# Altium project PROC101D_SCH_With_Design_Updates..Notes_V1.0.PrjPcb (part 23 of 23)
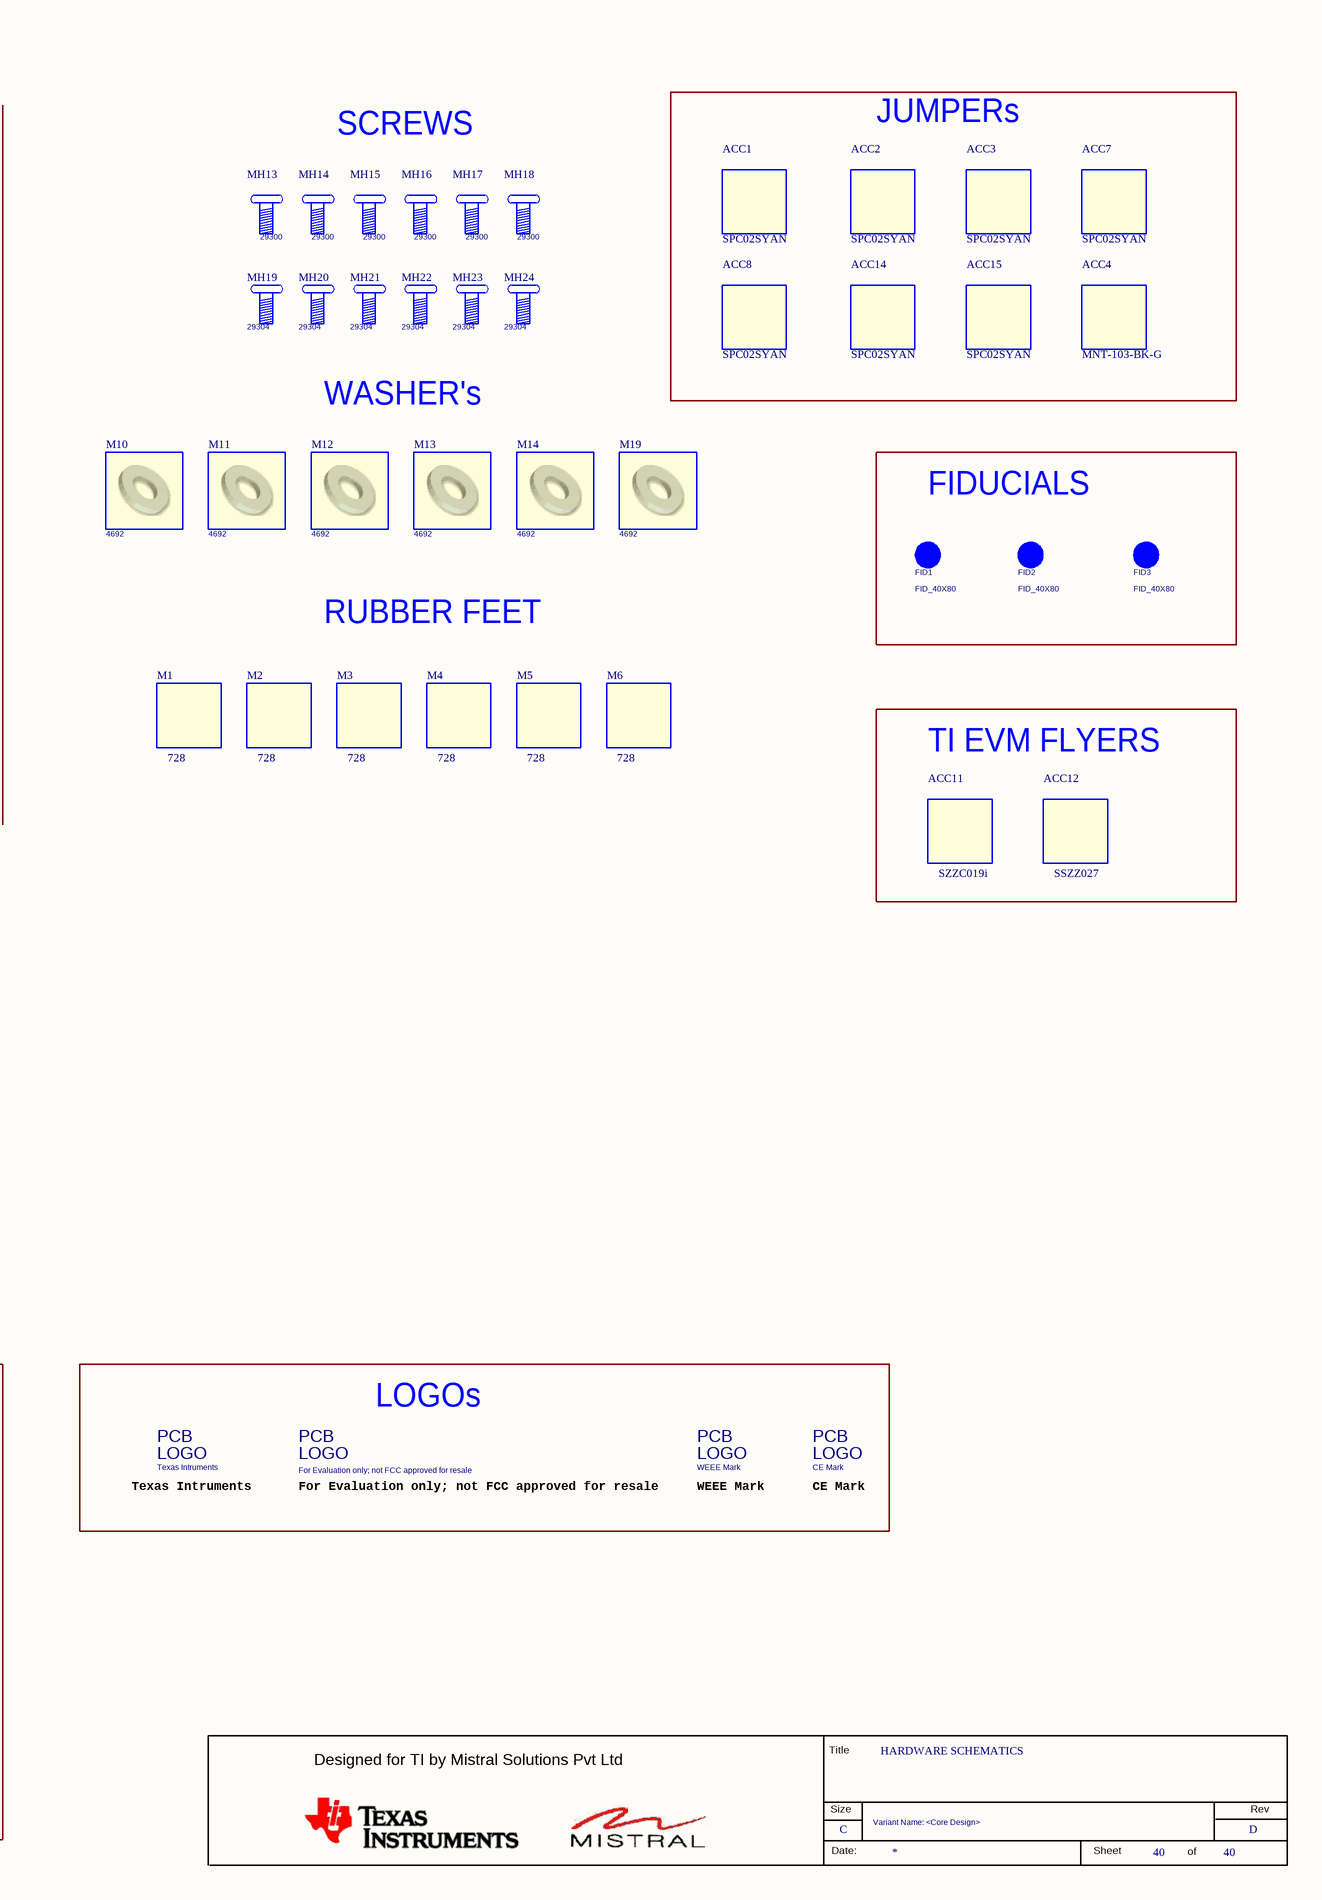
[diagram p78: 40.SchDoc, right]

## Nets that join several sheets
DDR_VREFCA: 12 (C42.2 U13.M1), 39 (C218.1 U68.6)
DGND: 09 (42 pins), 10 (74 pins), 11 (68 pins), 12 (54 pins), 13 (39 pins), 14 (15 pins), 15 (17 pins), 16 (45 pins), 17 (38 pins), 18 (36 pins), 19 (12 pins), 20 (37 pins), 21 (23 pins), 22 (46 pins), 23 (35 pins), 24 (36 pins), 25 (15 pins), 26 (58 pins), 27 (68 pins), 28 (8 pins), 29 (31 pins), 30 (37 pins), 31 (60 pins), 32 (16 pins), 33 (8 pins), 34 (22 pins), 35 (35 pins), 36 (19 pins), 37 (53 pins), 38 (35 pins), 39 (42 pins)
PRG_EARTH: 17 (J21.SH3 J21.SH4), 18 (C295.1 J21.SH1 J21.SH2 R304.1)
SOC_DVDD1V8: 09 (6 pins), 10 (6 pins), 21 (J13.2 R233.3)
SoC_DVDD3V3: 09 (17 pins), 10 (19 pins), 21 (J19.2 R295.1)
VCC1V2_DDR: 21 (C21.2 J8.1 R22.1), 38 (5 pins)
VCC1V8: 13 (20 pins), 14 (22 pins), 21 (C221.2 J13.1 R233.2), 27 (C212.1 U63.1 U63.3), 31 (FB25.1 FL17.1 FL18.1), 33 (C30.2 R24.2 U10.3), 34 (C485.2 R575.1 U35.5), 38 (5 pins)
VCC3V3_PREREG: 35 (5 pins), 37 (6 pins), 38 (21 pins)
VCC3V3_XDS: 22 (37 pins), 23 (6 pins)
VCC_3V3_SYS: 13 (15 pins), 14 (R197.2 R210.2), 15 (17 pins), 16 (34 pins), 17 (26 pins), 18 (24 pins), 19 (C161.1 U51.8), 20 (22 pins), 21 (20 pins), 23 (28 pins), 24 (23 pins), 25 (R153.1), 26 (13 pins), 27 (C216.1 R19.2 U64.1 U64.3), 28 (C26.1 C29.1 J7.10 U8.5), 29 (16 pins), 30 (13 pins), 31 (5 pins), 32 (10 pins), 33 (6 pins), 34 (11 pins), 35 (10 pins), 36 (6 pins), 37 (7 pins), 38 (R143.2), 39 (18 pins)
VCC_5V0: 09 (R314.1), 25 (C139.2 FL7.1), 27 (C15.1 U2.1 U2.3), 29 (FB2.1), 35 (C271.2 R266.1 U74.5), 37 (8 pins)
VCC_CORE: 21 (C72.2 J20.1 R92.3), 38 (C77.1 C486.1 L4.2 TP23.1)
VDD_0V85: 21 (C31.2 J11.1 R227.4), 38 (C33.1 TP8.1 U12.8)
VDD_1V0: 16 (13 pins), 39 (C280.1 TP56.1 U77.1)
VDD_1V1: 17 (10 pins), 18 (10 pins), 39 (5 pins)
VDD_2V5: 16 (7 pins), 17 (7 pins), 18 (7 pins), 39 (5 pins)
VDD_2V8: 29 (C463.2 J36.7 R538.1), 39 (C471.1 R556.1 TP99.1 U100.1)
VDD_CORE: 09 (13 pins), 10 (19 pins), 21 (J20.2 R92.2), 35 (R284.1), 38 (C96.1 R118.1 TP14.1)
VDD_DDR4: 09 (7 pins), 10 (11 pins), 12 (37 pins), 21 (J8.2 R22.4), 39 (C213.2 U68.1)
VDD_MMC1: 09 (U23.H15), 10 (C119.1 C382.1), 13 (5 pins)
VDDA1V8: 21 (C117.2 J22.1 R351.2), 38 (C129.1 R144.1 TP29.1 U33.1)
VDDA_1V8: 09 (10 pins), 10 (5 pins), 21 (J22.2 R351.3)
VDDA_1V8_SERDES: 09 (5 pins), 30 (R632.2)
VDDA_ADC: 09 (5 pins), 32 (C4.2 C7.2 J3.4 J3.17)
VDDAR_CORE: 09 (R75.1 R297.1), 21 (J11.2 R227.1), 38 (R44.1 TP10.1)
VDDR_CORE: 09 (R106.2 R297.2 U23.L10 U23.M13), 10 (6 pins), 35 (R282.1)
VDDR_VTT: 12 (38 pins), 39 (C210.2 TP48.1 U68.3 U68.5)
VDDS_MMC0/ADC0_VREFP: 09 (R698.2 R699.1 U23.J15), 11 (C541.1)
VDDSHV_SD_IO: 09 (C400.1 U23.K15 U23.L14 U23.L15), 10 (C372.1 C381.1), 13 (9 pins)
VMAIN: 09 (R604.1), 30 (10 pins), 36 (C56.1 D3.3 R80.2 TP81.1), 37 (10 pins), 39 (C452.1 R500.1 U97.2)
VOUT_TA: 19 (18 pins), 20 (12 pins), 37 (C494.2 U102.5), 39 (7 pins)
VPP_1V8: 09 (U23.G15), 38 (C243.1 TP52.1 U72.1)
VPP_DDR_2V5: 12 (FB11.1), 39 (C201.1 TP47.1 U62.1)
BOOTMODE0: 20 (R325.1), 28 (RA1.8 RA2.1 U23.T20)
BOOTMODE1: 20 (R326.1), 28 (RA1.7 RA2.2 U23.U21)
BOOTMODE2: 20 (R327.1), 28 (RA1.6 RA2.3 U23.T18)
BOOTMODE3: 20 (R328.1), 28 (RA1.5 RA2.4 U23.U20)
BOOTMODE4: 20 (R329.1), 28 (RA1.4 RA2.5 U23.U18)
BOOTMODE5: 20 (R330.1), 28 (RA1.3 RA2.6 U23.U19)
BOOTMODE6: 20 (R331.1), 28 (RA1.2 RA2.7 U23.V20)
BOOTMODE7: 20 (R332.1), 28 (RA1.1 RA2.8 U23.V21)
BOOTMODE8: 20 (R372.1), 28 (RA3.8 RA4.1 U23.V19)
BOOTMODE9: 20 (R373.1), 28 (RA3.7 RA4.2 U23.T17)
BOOTMODE10: 20 (R374.1), 28 (RA3.6 RA4.3 U23.R16)
BOOTMODE11: 20 (R375.1), 28 (RA3.5 RA4.4 U23.W20)
BOOTMODE12: 20 (R376.1), 28 (RA3.4 RA4.5 U23.W21)
BOOTMODE13: 20 (R377.1), 28 (RA3.3 RA4.6 U23.V18)
BOOTMODE14: 20 (R378.1), 28 (RA3.2 RA4.7 U23.Y21)
BOOTMODE15: 20 (R379.1), 28 (RA3.1 RA4.8 U23.Y20)
BOOTMODE_I2C_SCL: 19 (J38.37 R550.2), 20 (TP43.1 U96.29)
BOOTMODE_I2C_SDA: 19 (J38.39 R551.2), 20 (TP42.1 U96.30)
CAN_MUX_SEL: 29 (R16.1 U67.1), 33 (U91.2)
CDC_OE1/OE4: 31 (R672.2 R688.2 U105.11), 33 (U91.18)
CLKGEN_REFCLK1N: 30 (R661.1), 31 (R653.2 R682.1)
CLKGEN_REFCLK1P: 30 (R662.1), 31 (R652.2 R681.1)
CLKGEN_REFCLK4N: 30 (R667.1), 31 (R655.2 R684.1)
CLKGEN_REFCLK4P: 30 (R668.1), 31 (R654.2 R683.1)
CLKOUT0: 29 (R345.2), 31 (R50.2 R257.1 U70.13)
CPSW_FET_SEL: 16 (R292.1 U75.9 U75.10), 33 (U91.11)
CPSW_RGMII1_ETH1_CLK: 16 (U15.15), 31 (R239.2)
CPSW_RGMII1_MDC: 16 (R81.2 U15.16), 17 (U27.7), 27 (TP64.1 U23.R2)
CPSW_RGMII1_MDIO: 16 (R79.1 U15.17), 17 (U27.3), 27 (TP20.1 U23.P5)
CPSW_RGMII1_TD0: 16 (U15.28), 27 (U23.V15)
CPSW_RGMII1_TD1: 16 (U15.27), 27 (U23.V14)
CPSW_RGMII1_TD2: 16 (U15.26), 27 (U23.W14)
CPSW_RGMII1_TD3: 16 (U15.25), 27 (U23.AA14)
CPSW_RGMII1_TX_CTL: 16 (U15.37), 27 (U23.U15)
CPSW_RGMII1_TXC: 16 (U15.29), 27 (U23.U14)
DDR_VTT_EN: 14 (U23.L18), 33 (U10.5)
DDR_VTT_EN_3V3: 33 (U10.8), 39 (R29.1 TP7.1 U68.7 U68.9)
Debounce_MCU_RESETz: 34 (6 pins), 35 (U50.1)
FSI_FET_SEL: 28 (R218.1 U8.11 U8.21), 33 (U91.8)
GPIO1_43_INTn: 29 (U23.C13), 35 (R471.2)
GPIO_CPSW1_RST: 16 (R241.1 R242.1 U69.1), 33 (U91.3)
GPIO_eMMC_RSTn: 13 (R196.1 U54.1), 33 (U91.1)
GPIO_OLED_RESETn: 29 (J36.6 R531.2), 33 (U91.15)
GPIO_PCIe_RST_OUT: 30 (R424.2 R430.1 U88.1), 33 (U91.6)
GPIO_RGMII1_RST: 18 (R300.1 R301.1 U19.1), 33 (U91.4)
GPIO_RGMII2_RST: 17 (R371.1 R380.1 U31.1), 33 (U91.5)
GPMC0_AD0: 27 (J2.E14), 28 (RA1.9)
GPMC0_AD1: 27 (J2.D14), 28 (RA1.10)
GPMC0_AD2: 27 (J2.C14), 28 (RA1.11)
GPMC0_AD3: 27 (J2.E15), 28 (RA1.12)
GPMC0_AD4: 27 (J2.D15), 28 (RA1.13)
GPMC0_AD5: 27 (J2.C15), 28 (RA1.14)
GPMC0_AD6: 27 (J2.E17), 28 (RA1.15)
GPMC0_AD7: 27 (J2.D17), 28 (RA1.16)
GPMC0_AD8: 27 (J2.A22), 28 (U8.23)
GPMC0_AD9: 27 (J2.A21), 28 (U8.22)
GPMC0_AD10: 27 (J2.B21), 28 (U8.20)
GPMC0_AD11: 27 (J2.E21), 28 (RA3.12)
GPMC0_AD12: 27 (J2.C21), 28 (RA3.13)
GPMC0_AD13: 27 (J2.D21), 28 (RA3.14)
GPMC0_AD14: 27 (J2.B20), 28 (U8.18)
GPMC0_AD15: 27 (J2.A19), 28 (U8.16)
GPMC0_CSn1: 27 (J2.E19), 28 (U23.R20)
GPMC0_CSn2: 27 (J2.D18), 28 (U23.P19)
GPMC0_CSn3: 27 (J2.D19), 28 (U23.R21)
GPMC0_DIR: 27 (J2.E18), 28 (U23.N17)
HSE_DETECT: 15 (R224.1 U66.4), 27 (J2.E4)
HSE_GPIO0_31: 27 (J2.B22), 28 (RA5.9)
HSE_GPIO0_32: 27 (J2.C22), 28 (RA5.10)
HSE_GPIO0_33: 27 (J2.D22), 28 (RA5.11)
HSE_GPIO0_34: 27 (J2.C23), 28 (RA5.12)
HSE_GPIO0_35: 27 (J2.B24), 28 (RA5.13)
HSE_GPIO0_36: 27 (J2.A20), 28 (U8.19)
HSE_GPIO0_37: 27 (J2.C24), 28 (RA5.15)
HSE_GPIO0_38: 27 (J2.E26), 28 (RA5.16)
HSE_GPIO0_39: 27 (J2.C26), 28 (R393.2)
HSE_GPIO0_41: 27 (J2.D26), 28 (R390.2)
HSE_MCAN0_RX/UART4_TXD: 27 (J2.E24), 29 (U67.3)
HSE_MCAN0_TX/UART4_RXD: 27 (J2.D24), 29 (U67.6)
HSE_MCAN1_RX/I2C3_SDA: 27 (J2.C29), 29 (U67.10)
HSE_MCAN1_TX/I2C3_SCL: 27 (J2.D29), 29 (U67.13)
HSE_PRG0_PRU0_GPO9: 16 (U75.33), 27 (J2.D28)
HSE_PRG0_PRU0_GPO10: 16 (U75.31), 27 (J2.B29)
HSE_PRG0_PRU1_GPO7: 16 (U75.42), 27 (J2.D23)
HSE_PRG0_PRU1_GPO9: 16 (U75.40), 27 (J2.E23)
HSE_PRG0_PRU1_GPO10: 16 (U75.37), 27 (J2.E27)
HSE_PRG0_PRU1_GPO17: 16 (U75.35), 27 (J2.C28)
IO_EXP_INTn_SDIO: 13 (U23.C20), 33 (R465.1 U91.32)
JTAG_EMU0: 23 (R455.2 U45.8), 24 (J25.13 U48.8)
JTAG_EMU1: 23 (R458.2 U45.1), 24 (J25.14 U48.1)
JTAG_EMU_RSTn: 24 (J25.15 R150.2 R449.1), 35 (U41.6)
JTAG_TCK: 23 (R640.2 U37.12), 24 (U60.4)
JTAG_TDI: 23 (R642.2 U37.10), 24 (J25.3 R410.2)
JTAG_TDO: 23 (U46.7), 24 (J25.7 R450.1)
JTAG_TMS: 23 (R641.2 U37.11), 24 (J25.1 R451.1)
JTAG_TRST#: 23 (R643.2 U37.13), 24 (C529.2 R448.1 R685.2)
MCAN0_STB_3V3: 29 (R9.2 U4.8), 33 (U91.9)
MCAN1_STB_3V3: 29 (R8.2 U3.8), 33 (U91.10)
MCU_GPIO0_6: 34 (J1.8 U23.B7), 35 (R470.2)
MCU_PORz: 27 (J2.E30), 34 (5 pins)
MCU_RESETSTATz: 27 (J2.E3), 34 (J1.19 TP1.1 U23.B13)
MCU_RESETz: 27 (J2.D3), 34 (TP46.1 U23.B12), 35 (R477.2 U50.7)
MCU_SAFETY_ERRORz_1V8: 33 (U10.4), 34 (TP72.1 U23.A20)
MCU_SAFETY_ERRORz_3V3: 33 (U10.1), 34 (J1.22)
MCU_UART0_CTS_3V3: 26 (U82.9), 34 (U23.D8)
MCU_UART0_RTS_3V3: 26 (U82.7), 34 (U23.E8)
MCU_UART0_RX_3V3: 26 (U82.8), 34 (U23.A9)
MCU_UART0_TX_3V3: 26 (R611.2 U82.6), 34 (U23.A8)
MIPI_TRC_CLK: 24 (J33.13), 28 (RA2.16)
MIPI_TRC_CTL: 24 (J33.17), 28 (RA2.15)
MIPI_TRC_DAT00: 24 (J33.19), 28 (RA2.14)
MIPI_TRC_DAT01: 24 (J33.21), 28 (RA2.13)
MIPI_TRC_DAT02: 24 (J33.23), 28 (RA2.12)
MIPI_TRC_DAT03: 24 (J33.25), 28 (RA2.11)
MIPI_TRC_DAT04: 24 (J33.27), 28 (RA2.10)
MIPI_TRC_DAT05: 24 (J33.29), 28 (RA2.9)
MIPI_TRC_DAT06: 24 (J33.31), 28 (RA4.16)
MIPI_TRC_DAT07: 24 (J33.33), 28 (RA4.15)
MIPI_TRC_DAT08: 24 (J33.35), 28 (RA4.14)
MIPI_TRC_DAT09: 24 (J33.37), 28 (RA4.13)
MIPI_TRC_DAT10: 24 (J33.39), 28 (RA4.12)
MIPI_TRC_DAT11: 24 (J33.41), 28 (RA4.11)
MIPI_TRC_DAT12: 24 (J33.43), 28 (RA4.10)
MIPI_TRC_DAT13: 24 (J33.45), 28 (RA4.9)
MIPI_TRC_DAT14: 24 (J33.47), 28 (RA6.16)
MIPI_TRC_DAT15: 24 (J33.49), 28 (RA6.15)
MIPI_TRC_DAT16: 24 (J33.51), 28 (RA6.14)
MIPI_TRC_DAT17: 24 (J33.53), 28 (RA6.13)
MIPI_TRC_DAT18: 24 (J33.55), 28 (RA6.12)
MIPI_TRC_DAT19: 24 (J33.18), 28 (RA6.11)
MIPI_TRC_DAT20: 24 (J33.20), 28 (RA6.10)
MIPI_TRC_DAT21: 24 (J33.22), 28 (RA6.9)
MIPI_TRC_DAT22: 24 (J33.24), 28 (R392.2)
MIPI_TRC_DAT23: 24 (J33.26), 28 (R391.2)
MMC1_SD_EN: 13 (R416.1 U86.1), 33 (U91.7)
PCIe_MCU_PORz: 30 (J34.3 R576.2), 34 (U35.6)
PORz: 34 (R574.2 U35.1), 35 (R171.2 TP32.1)
PORz_OUT: 13 (U86.6), 16 (U69.2), 17 (U31.2), 18 (U19.2), 20 (R434.2), 34 (R348.2 TP82.1 U23.E17)
PRG0_HSE_ETH1_CLK: 27 (J2.A17), 31 (R236.2)
PRG0_HSE_ETH2_CLK: 27 (J2.B17), 31 (R235.2)
PRG0_PRU0_GPO9/CPSW_RGMII1_RX_CTL: 16 (U75.6), 27 (U23.W6)
PRG0_PRU0_GPO10/CPSW_RGMII1_RXC: 16 (U75.7), 27 (U23.AA5)
PRG0_PRU1_GPO7/CPSW_RGMII1_RD0: 16 (U75.2), 27 (U23.W5)
PRG0_PRU1_GPO9/CPSW_RGMII1_RD1: 16 (U75.3), 27 (U23.Y5)
PRG0_PRU1_GPO10/CPSW_RGMII1_RD2: 16 (U75.4), 27 (U23.V6)
PRG0_PRU1_GPO17/CPSW_RGMII1_RD3: 16 (U75.5), 27 (U23.V5)
PRG1_ETH2_LED_1000/RX_ER: 17 (R343.2 R386.1 R388.2 U80.46), 27 (U23.AA13)
PRG1_ETH2_LED_LINK: 17 (R562.2 R563.1 U80.47), 27 (U23.U12)
PRG1_ETH3_LED_1000/RX_ER: 18 (R94.2 R96.1 R99.2 U20.46), 27 (U23.V13)
PRG1_ETH3_LED_LINK: 18 (R564.2 R565.1 U20.47), 27 (U23.W13)
PRG1_MDIO_MDC: 17 (U27.8), 18 (R104.2 U20.42), 27 (TP21.1 U23.Y6)
PRG1_MDIO_MDIO: 17 (U27.2), 18 (R103.1 U20.41), 27 (TP22.1 U23.AA6)
PRG1_RGMII1_ETH3_CLK: 18 (U20.20), 31 (R237.2)
PRG1_RGMII1_RD0: 18 (R108.1 R310.2 U20.33), 27 (U23.Y7)
PRG1_RGMII1_RD1: 18 (R107.1 R308.2 U20.34), 27 (U23.U8)
PRG1_RGMII1_RD2: 18 (U20.35), 27 (U23.W8)
PRG1_RGMII1_RD3: 18 (U20.36), 27 (U23.V8)
PRG1_RGMII1_RX_CTL: 18 (R100.1 R101.2 U20.38), 27 (U23.Y8)
PRG1_RGMII1_RXC: 18 (U20.32), 27 (U23.AA7)
PRG1_RGMII1_TD0: 18 (U20.28), 27 (U23.AA8)
PRG1_RGMII1_TD1: 18 (U20.27), 27 (U23.U9)
PRG1_RGMII1_TD2: 18 (U20.26), 27 (U23.W9)
PRG1_RGMII1_TD3: 18 (U20.25), 27 (U23.AA9)
PRG1_RGMII1_TX_CTL: 18 (U20.37), 27 (U23.Y9)
PRG1_RGMII1_TXC: 18 (U20.29), 27 (U23.V9)
PRG1_RGMII2_ETH2_CLK: 17 (U80.20), 31 (R238.2)
PRG1_RGMII2_FET_SEL: 17 (R120.1 U27.1), 33 (U91.13)
PRG1_RGMII2_RD0: 17 (R126.2 R359.1 U80.33), 27 (U23.W11)
PRG1_RGMII2_RD1: 17 (R128.2 R363.1 U80.34), 27 (U23.V11)
PRG1_RGMII2_RD2: 17 (U80.35), 27 (U23.AA12)
PRG1_RGMII2_RD3: 17 (U80.36), 27 (U23.Y12)
PRG1_RGMII2_RX_CTL: 17 (R135.1 R366.2 U80.38), 27 (U23.W12)
PRG1_RGMII2_RXC: 17 (U80.32), 27 (U23.U11)
PRG1_RGMII2_TD0: 17 (U80.28), 27 (U23.AA10)
PRG1_RGMII2_TD1: 17 (U80.27), 27 (U23.V10)
PRG1_RGMII2_TD2: 17 (U80.26), 27 (U23.U10)
PRG1_RGMII2_TD3: 17 (U80.25), 27 (U23.AA11)
PRG1_RGMII2_TX_CTL: 17 (U80.37), 27 (U23.Y11)
PRG1_RGMII2_TXC: 17 (U80.29), 27 (U23.Y10)
PRG1_RGMII_INTn: 16 (R250.1), 17 (R368.1 U80.44), 18 (R105.1 U20.44), 34 (R597.1)
RESETSTATz: 13 (U54.2 U86.3), 14 (U85.2), 20 (R435.2), 30 (U88.2), 31 (U105.8), 33 (U91.28), 34 (R344.2 TP68.1 U23.F16)
SEL_XDS110_INV: 23 (7 pins), 24 (7 pins)
SoC_CLKIN: 31 (R272.2), 34 (R137.1)
SoC_I2C0_SCL: 15 (U7.6 U66.14), 27 (J2.E1), 29 (R358.2 R598.1), 33 (J5.3)
SoC_I2C0_SDA: 15 (U7.5 U66.15), 27 (J2.E2), 29 (R354.2 R599.1), 33 (J5.2)
SoC_I2C1_SCL: 15 (TP25.1 U18.1 U29.1), 19 (U51.7), 21 (11 pins), 29 (J36.5 R353.2 U23.C18), 30 (J27.B5), 31 (R659.1), 32 (U34.15), 33 (U91.29)
SoC_I2C1_SDA: 15 (TP27.1 U18.6 U29.6), 19 (U51.6), 21 (11 pins), 29 (J36.4 R357.2 U23.B19), 30 (J27.B6), 31 (R660.1), 32 (U34.2), 33 (U91.30)
SOC_MAIN_UART0_CTS_3V3: 26 (U84.9), 29 (U23.B16)
SOC_MAIN_UART0_RTS_3V3: 26 (U84.7), 29 (U23.A16)
SOC_MAIN_UART0_RX_3V3: 26 (U84.8), 29 (U23.D15)
SOC_MAIN_UART0_TX_3V3: 26 (R608.2 U84.6), 29 (U23.C16)
SOC_MAIN_UART1_RX_3V3: 26 (U89.8), 29 (U23.E15)
SOC_MAIN_UART1_TX_3V3: 26 (R609.2 U89.6), 29 (U23.E14)
SOC_MAIN_UART3_RX_3V3: 26 (U89.9), 29 (U23.D16)
SOC_MAIN_UART3_TX_3V3: 26 (R610.2 U89.7), 29 (U23.E16)
SOC_SPI1_CLK: 27 (J2.C1), 29 (U23.C14)
SOC_SPI1_CS0: 27 (J2.D1), 29 (U23.B14)
SOC_SPI1_CS1: 27 (J2.D2), 29 (U23.D14)
SOC_SPI1_MISO: 27 (J2.B1), 29 (U23.A15)
SOC_SPI1_MOSI: 27 (J2.B2), 29 (U23.B15)
SoC_WARM_RESETZ: 34 (TP70.1 U23.E18), 35 (R476.1 U50.2)
TEST_GPIO1: 19 (R523.1 R545.1), 35 (Q17.1)
TEST_GPIO2: 19 (R524.1 R546.1), 33 (U91.14)
TEST_GPIO3: 19 (R525.1 R547.1 TP41.1), 20 (J30.1 R439.2 U90.2)
TEST_GPIO4: 19 (R526.1 R548.1 TP40.1), 20 (U96.28)
TEST_LED1: 14 (R549.2 R553.2), 33 (U91.17)
TEST_LED2: 14 (R552.2 R554.2), 34 (J1.7 U23.A7)
TEST_PORZn: 19 (R521.1 R543.1), 35 (Q9.1)
TEST_POWERDOWN: 19 (R542.1), 37 (R412.1)
TEST_WARMRESETn: 19 (R522.1 R544.1), 35 (Q10.1)
VCC1V1_PG: 36 (R136.2), 39 (R396.1 U32.5)
VCC1V2_PG: 36 (R14.2), 38 (5 pins)
VCC2V5_PG: 36 (R217.2), 39 (R225.1 U9.5)
VCC3V3_SYS_PG: 37 (C118.1 R131.2 U30.24), 38 (R580.2 R583.2 TP49.1), 39 (R589.2 TP97.1)
VCC_CORE_PG: 36 (R312.2), 37 (U102.2), 38 (R123.1 U25.8 U104.2)
VDD1V8_PG: 36 (R127.2), 38 (6 pins)
VDD_0V85_PG: 36 (R20.2), 38 (R58.1 U12.2 U103.2)
VIN_MON_PORz_3V3_PG: 35 (C57.1 R259.2 U41.3 U74.1), 37 (R578.2 U17.10), 39 (5 pins)
VPP_LDO_EN: 33 (U91.16), 38 (R263.2 R582.2 TP53.1)
XDS110_EMU0: 22 (R202.2 U59.42), 23 (U55.8)
XDS110_EMU1: 22 (R203.2 U59.43), 23 (U55.1)
XDS110_TCK: 22 (U59.35), 23 (U98.12)
XDS110_TDI: 22 (U59.38), 23 (U98.13)
XDS110_TDO: 22 (U59.37), 23 (U56.7)
XDS110_TMS: 22 (U59.36), 23 (U98.11)
XDS110_TRST#: 22 (U59.40), 23 (U98.10)